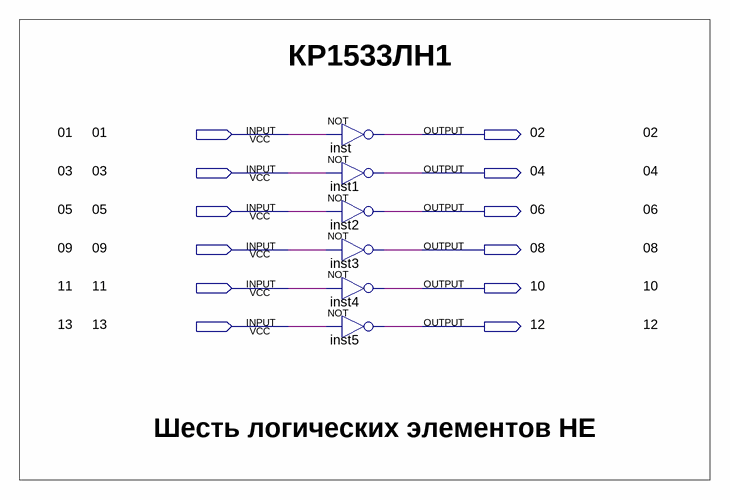
[diagram p0: schematic sheet]
// Quartus schematic KP1533LN1.bdf as structural Verilog: 6 symbols, 12 pins
module KP1533LN1 (
  input  \01 ,
  input  \03 ,
  input  \05 ,
  input  \09 ,
  input  \11 ,
  input  \13 ,
  output \02 ,
  output \04 ,
  output \06 ,
  output \08 ,
  output \10 ,
  output \12 
);

  not inst (\02 , \01 );
  not inst1 (\04 , \03 );
  not inst2 (\06 , \05 );
  not inst3 (\08 , \09 );
  not inst4 (\10 , \11 );
  not inst5 (\12 , \13 );

  // Notes on the sheet:
  //   КР1533ЛН1
  //   01
  //   02
  //   03
  //   04
  //   05
  //   06
  //   09
  //   08
  //   11
  //   10
  //   13
  //   12
  //   Шесть логических элементов НЕ
endmodule
